# EAGLE design demo_robot_platform (EAGLE 9.6.2)
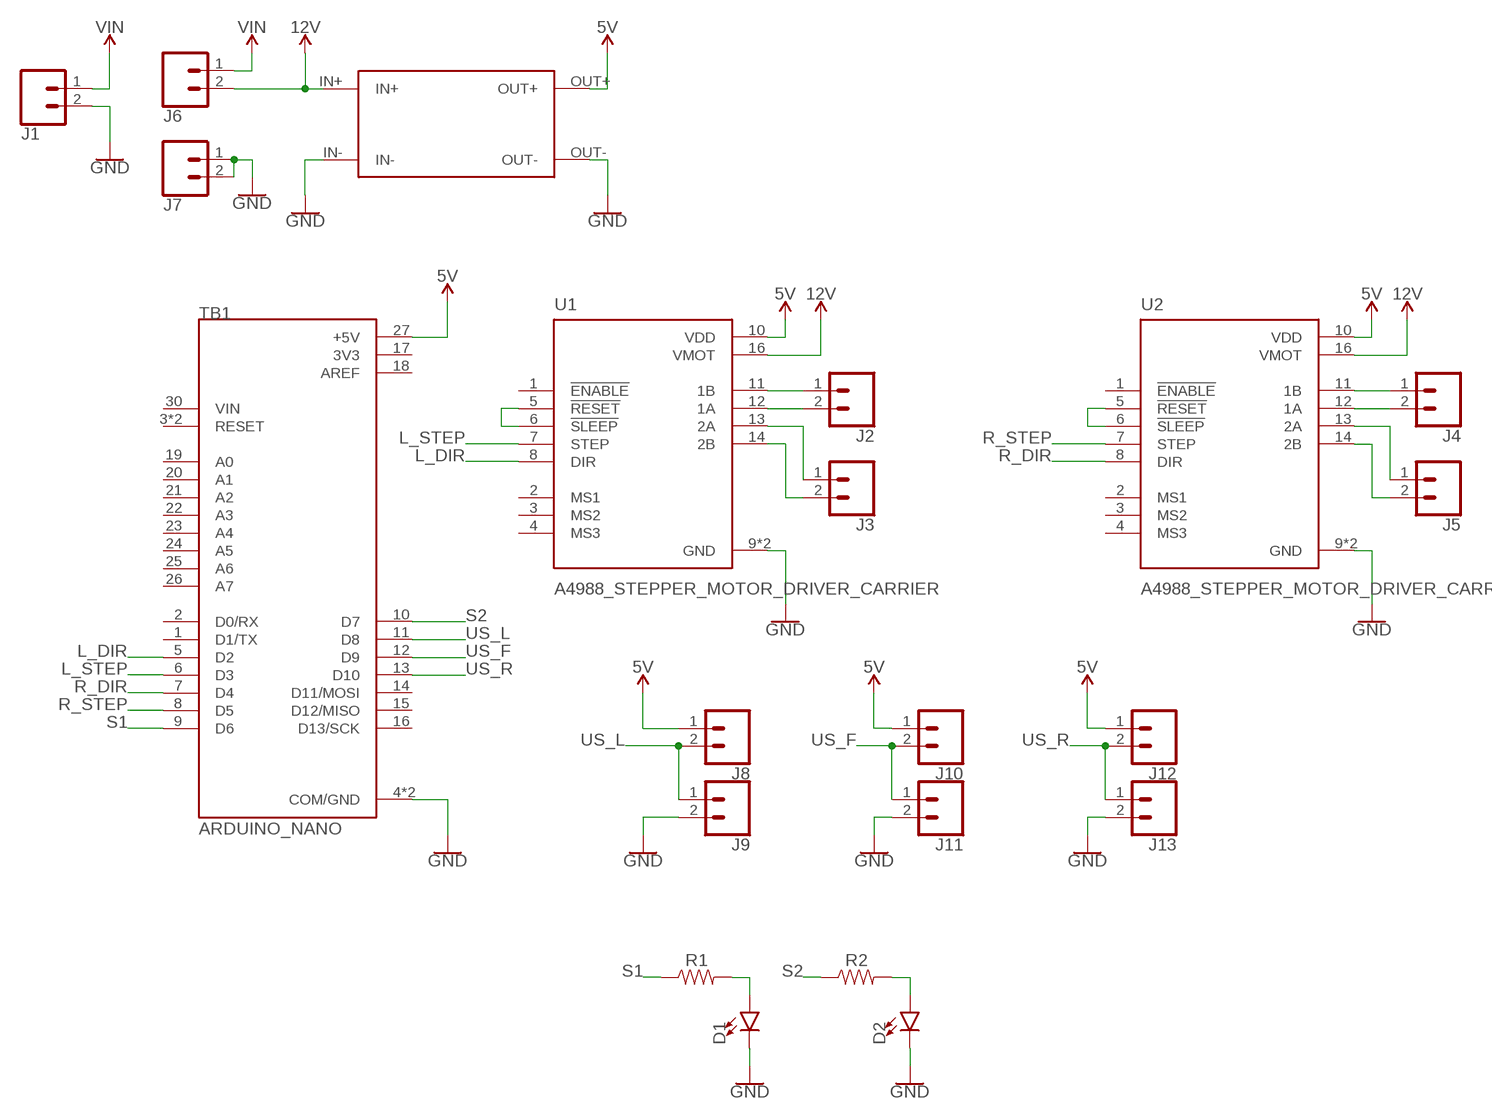
[diagram p0: schematic, sheet 1]

## Parts
D1  LED5MM  [LED_5MM]
D2  LED5MM  [LED_5MM]
J1  CONN_025MM  [SCREWTERMINAL-5MM-2]
J2  CONN_025MM  [SCREWTERMINAL-5MM-2]
J3  CONN_025MM  [SCREWTERMINAL-5MM-2]
J4  CONN_025MM  [SCREWTERMINAL-5MM-2]
J5  CONN_025MM  [SCREWTERMINAL-5MM-2]
J6  CONN_025MM  [SCREWTERMINAL-5MM-2]
J7  CONN_025MM  [SCREWTERMINAL-5MM-2]
J8  CONN_025MM  [SCREWTERMINAL-5MM-2]
J9  CONN_025MM  [SCREWTERMINAL-5MM-2]
J10  CONN_025MM  [SCREWTERMINAL-5MM-2]
J11  CONN_025MM  [SCREWTERMINAL-5MM-2]
J12  CONN_025MM  [SCREWTERMINAL-5MM-2]
J13  CONN_025MM  [SCREWTERMINAL-5MM-2]
R1  RESISTORAXIAL-0.3  [AXIAL-0.3]
R2  RESISTORAXIAL-0.3  [AXIAL-0.3]
TB1  ARDUINO_NANO  [SHIELD_ARDUINO_NANO]
U1  A4988_STEPPER_MOTOR_DRIVER_CARRIER  [MODULE_A4988_STEPPER_MOTOR_DRIVER_CARRIER]
U2  A4988_STEPPER_MOTOR_DRIVER_CARRIER  [MODULE_A4988_STEPPER_MOTOR_DRIVER_CARRIER]
U$1  DC_DC_CONVERTER  [DC_DC_CONVERTER]

## Nets
5V: J8.1 J10.1 J12.1 TB1.27(+5V) U1.10(VDD) U2.10(VDD) U$1.OUT+
12V: J6.2 U1.16(VMOT) U2.16(VMOT) U$1.IN+
GND: D1.K(C) D2.K(C) J1.2 J7.1 J7.2 J9.2 J11.2 J13.2 TB1.4(COM/GND) TB1.29(COM/GND) U1.9(GND) U1.15(GND) U2.9(GND) U2.15(GND) U$1.IN- U$1.OUT-
L_DIR: TB1.5(D2) U1.8(DIR)
L_STEP: TB1.6(D3) U1.7(STEP)
N$1: J2.1 U1.11(1B)
N$2: J2.2 U1.12(1A)
N$3: J3.1 U1.13(2A)
N$4: J3.2 U1.14(2B)
N$5: J4.1 U2.11(1B)
N$6: J4.2 U2.12(1A)
N$7: J5.1 U2.13(2A)
N$8: J5.2 U2.14(2B)
N$9: U1.5(!RESET) U1.6(!SLEEP)
N$10: U2.5(!RESET) U2.6(!SLEEP)
N$13: D1.A R1.P$2
N$14: D2.A R2.P$2
R_DIR: TB1.7(D4) U2.8(DIR)
R_STEP: TB1.8(D5) U2.7(STEP)
S1: R1.P$1 TB1.9(D6)
S2: R2.P$1 TB1.10(D7)
US_F: J10.2 J11.1 TB1.12(D9)
US_L: J8.2 J9.1 TB1.11(D8)
US_R: J12.2 J13.1 TB1.13(D10)
VIN: J1.1 J6.1
Unconnected: TB1.1(D1/TX) TB1.2(D0/RX) TB1.3(RESET) TB1.14(D11/MOSI) TB1.15(D12/MISO) TB1.16(D13/SCK) TB1.19(A0) TB1.20(A1) TB1.21(A2) TB1.22(A3) TB1.23(A4) TB1.24(A5) TB1.25(A6) TB1.26(A7) TB1.28(RESET) TB1.30(VIN) U1.1(!ENABLE) U1.2(MS1) U1.3(MS2) U1.4(MS3) U2.1(!ENABLE) U2.2(MS1) U2.3(MS2) U2.4(MS3)

## Power pins joined to a net without a drawn wire
3V3: TB1.17(3V3)
AREF: TB1.18(AREF)

## Library data of the parts
D1 D2 = SparkFun-LED:LED: LED (Generic) Standard schematic elements and footprints for 5mm, 3mm, 1206, and 0603 sized LEDs. Generic LEDs with no color specified.
J1-J13 = SparkFun-Connectors:CONN_02: Multi connection point. Often used as Generic Header-pin footprint for 0.1 inch spaced/style header connections On any of the 0.1 inch spaced packages, you can populate with these: Break Away Headers - Straight <https://www.sparkfun.com/products/116> (PRT-00116) Break Away Male Headers - Right Angle <https://www.sparkfun.com/products/553> (PRT-00553) Female Headers <https://www.sparkfun.com/products/115> (PRT-00115) Break Away Headers - Machine Pin <https://www.sparkfun.com/products/117> (PRT-00117) Break Away Female Headers - Swiss Machine Pin <https://www.sparkfun.com/products/743> (PRT-00743) For SCREWTERMINALS and SPRING TERMINALS visit here: Screw Terimnals on SparkFun.com <https://www.sparkfun.com/search/results?term=Screw+Terminals> (5mm/3.5mm/2.54mm spacing) This device is also useful as a general connection point to wire up your design to another part of your project. Our various solder wires solder well into these plated through hole pads. Hook-Up Wire - Assortment (Stranded, 22 AWG) <https://www.sparkfun.com/products/11375> (PRT-11375) Hook-Up Wire - Assortment (Solid Core, 22 AWG) <https://www.sparkfun.com/products/11367> (PRT-11367) View the entire wire category on our website here <https://www.sparkfun.com/categories/141> Special notes: Molex polarized connector foot print use with: PRT-08233 with associated crimp pins and housings. 2.54_SCREWTERM for use with PRT-10571. 3.5mm Screw Terminal footprints for PRT-08084 5mm Screw Terminal footprints for use with PRT-08432; SF_SKU: PRT-08432
R1 R2 = SparkFun-Resistors:RESISTOR: Generic Resistor Package
TB1 = ARDUINO_NANO:ARDUINO_NANO: Arduino Nano, Through Hole Check availability <https://pricing.snapeda.com/parts/Arduino%20Nano/Arduino/view-part?ref=eda>; AVAILABILITY: Not in stock; DESCRIPTION: Small, complete, and breadboard-friendly board based on the ATmega328 (Arduino Nano 3.x); MF: Arduino; MP: Arduino Nano; PACKAGE: Non-Standard Arduino; PRICE: None
U1 U2 = A4988_STEPPER_MOTOR_DRIVER_CARRIER:A4988_STEPPER_MOTOR_DRIVER_CARRIER: Stepper motor controler; IC: A4988; 1A; Uin mot: 8÷35V Check availability <https://pricing.snapeda.com/parts/A4988%20STEPPER%20MOTOR%20DRIVER%20CARRIER/Pololu/view-part?ref=eda>; AVAILABILITY: Not in stock; DESCRIPTION: Stepper Motor Driver; MF: Pololu; MP: A4988 STEPPER MOTOR DRIVER CARRIER; PACKAGE: None; PRICE: None
U$1 = DC_DC_CONVERTER:DC_DC_CONVERTER

## Board
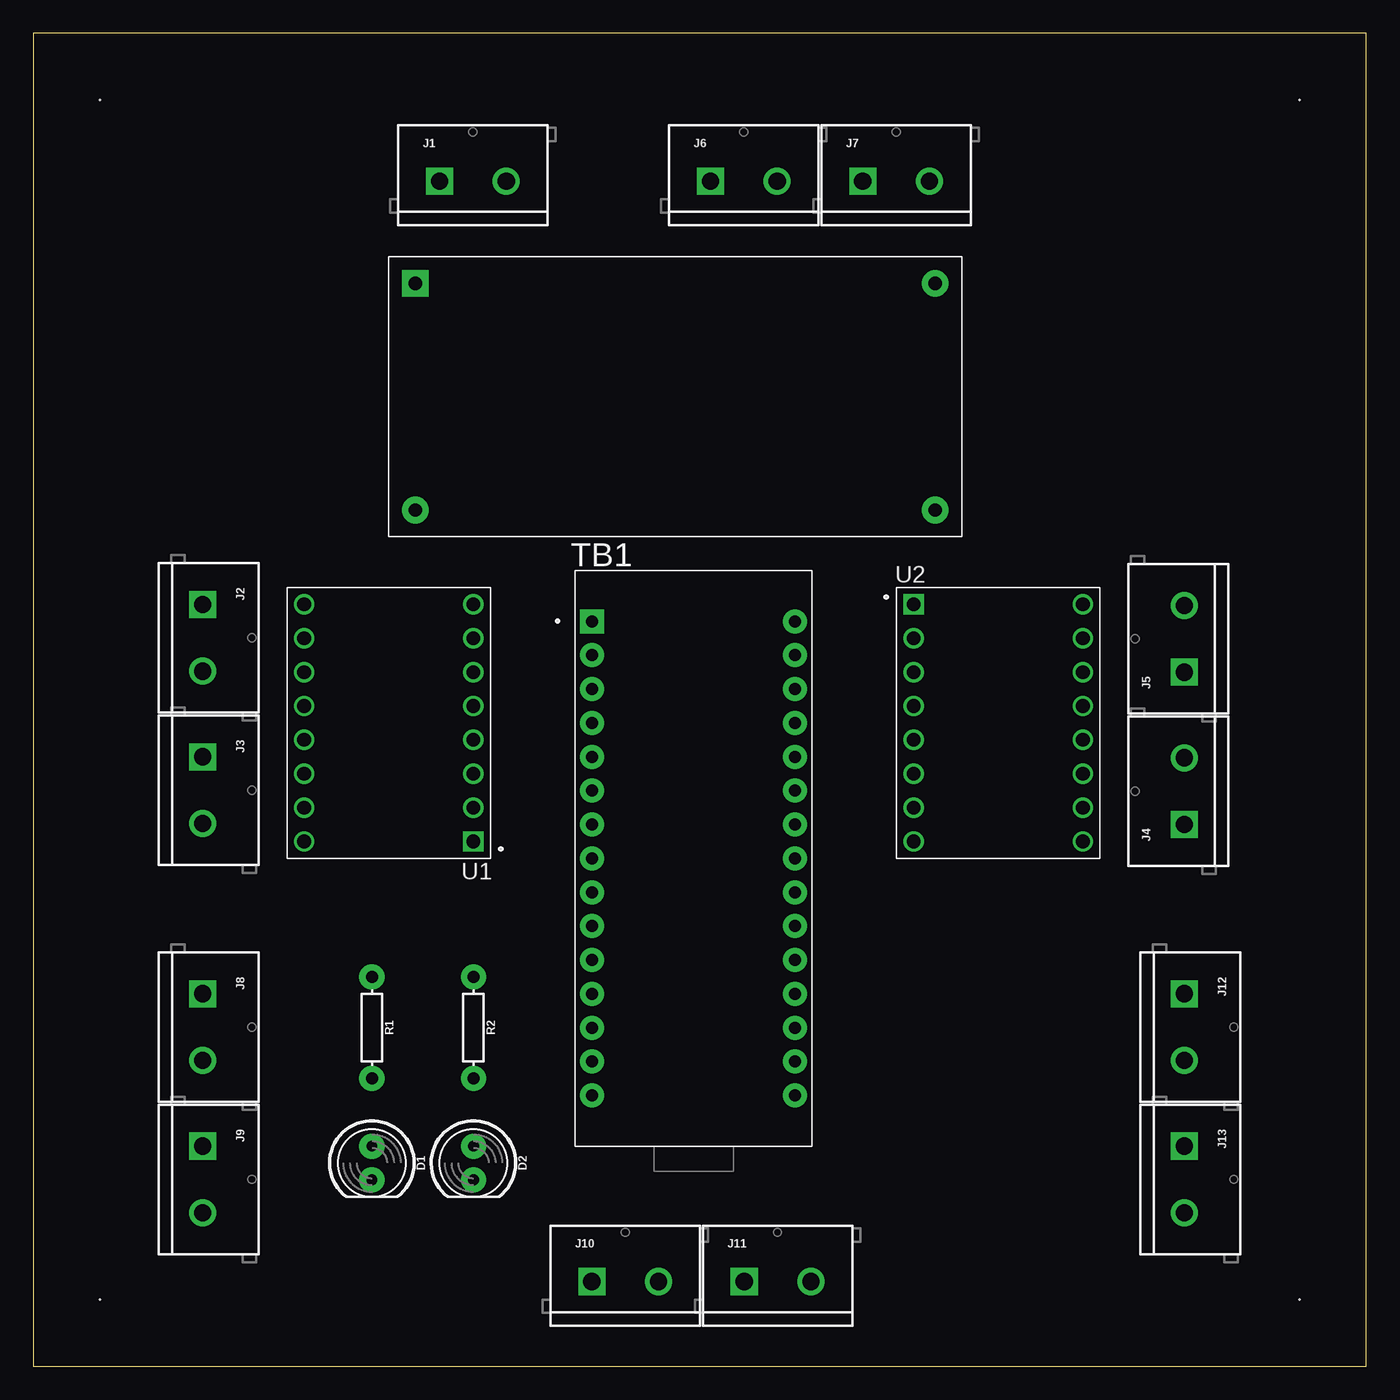
[diagram p1: board, top side]
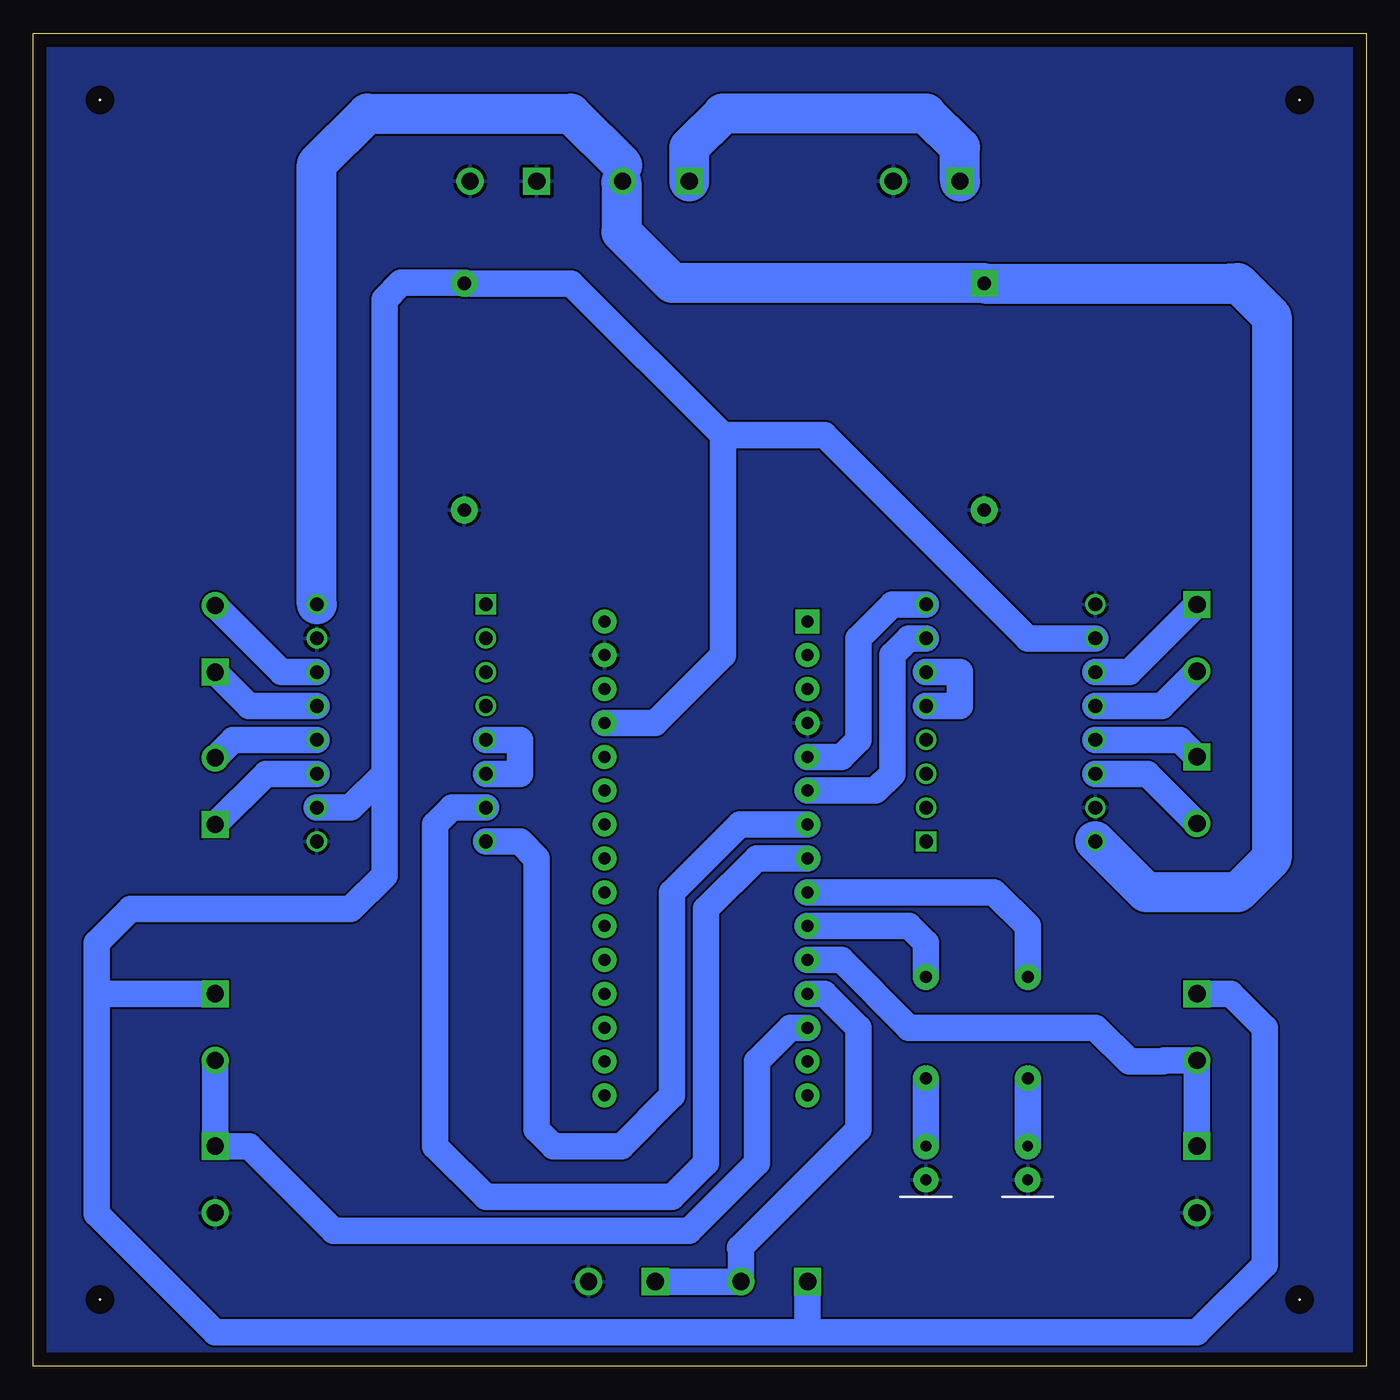
[diagram p2: board, bottom side, seen from below]

Size 100 x 100 mm. Coordinates in mm from the lower left corner, seen from the top.
Outline: 0,0 100,0 100,100 0,100 0,0
Copper layers (1*16): Top 0.035mm / dielectric 1.5mm / Bottom 0.035mm
Design rules "default": minimum track width 6mil, minimum drill 0.35mm, track to track 6mil, track to pad 6mil, pad to pad 6mil, via to via 6mil, smd to smd 6mil, copper to edge 40mil, drill to drill 6mil, minimum pad ring 10mil, minimum via ring 8mil, stop-mask expansion 4mil, vias tented up to drill 0mil, thermal gap 10mil
Holes 0.08 mm at 5,5 95,5 95,95 5,95

### Footprints (pad centres in the part's own frame; a part is rotated, then mirrored left to right if it is on the bottom)
LED_5MM = drill 0.813 pad 1.88: A -1.27,0; K 1.27,0
SCREWTERMINAL-5MM-2 = drill 1.3 pad 2.032 square: 1 0,0 | drill 1.3 pad 2.032: 2 5,0
AXIAL-0.3 = drill 0.9 pad 1.88: P$1 -3.81,0; P$2 3.81,0
SHIELD_ARDUINO_NANO = drill 0.9 pad 1.8 square: 1 -7.62,17.78 | drill 0.9 pad 1.8: 2 -7.62,15.24; 3 -7.62,12.7; 4 -7.62,10.16; 5 -7.62,7.62; 6 -7.62,5.08; 7 -7.62,2.54; 8 -7.62,0; 9 -7.62,-2.54; 10 -7.62,-5.08; 11 -7.62,-7.62; 12 -7.62,-10.16; 13 -7.62,-12.7; 14 -7.62,-15.24; 15 -7.62,-17.78; 16 7.62,-17.78; 17 7.62,-15.24; 18 7.62,-12.7; 19 7.62,-10.16; 20 7.62,-7.62; 21 7.62,-5.08; 22 7.62,-2.54; 23 7.62,0; 24 7.62,2.54; 25 7.62,5.08; 26 7.62,7.62; 27 7.62,10.16; 28 7.62,12.7; 29 7.62,15.24; 30 7.62,17.78
MODULE_A4988_STEPPER_MOTOR_DRIVER_CARRIER = drill 1.02 square: 1 -6.35,8.89 | drill 1.02: 2 -6.35,6.35; 3 -6.35,3.81; 4 -6.35,1.27; 5 -6.35,-1.27; 6 -6.35,-3.81; 7 -6.35,-6.35; 8 -6.35,-8.89; 9 6.35,-8.89; 10 6.35,-6.35; 11 6.35,-3.81; 12 6.35,-1.27; 13 6.35,1.27; 14 6.35,3.81; 15 6.35,6.35; 16 6.35,8.89
DC_DC_CONVERTER = drill 1 pad 2 square: IN+ 2,19 | drill 1 pad 2: IN- 2,2; OUT+ 41,19; OUT- 41,2

### Placement (x,y rotation side)
D1  25.4,15.24 270 top
D2  33.02,15.24 270 top
J1  30.48,88.9 0 top
J2  12.7,57.15 270 top
J3  12.7,45.72 270 top
J4  86.36,40.64 90 top
J5  86.36,52.07 90 top
J6  50.8,88.9 0 top
J7  62.23,88.9 0 top
J8  12.7,27.94 270 top
J9  12.7,16.51 270 top
J10  41.91,6.35 0 top
J11  53.34,6.35 0 top
J12  86.36,27.94 270 top
J13  86.36,16.51 270 top
R1  25.4,25.4 270 top
R2  33.02,25.4 270 top
TB1  49.53,38.1 0 top
U1  26.67,48.26 180 top
U2  72.39,48.26 0 top
U$1  26.67,62.23 0 top

### Tracks (layer width: path | path; a pad name or v marks a point on that pad's centre or on a via)
5V
  Bottom 2: 48.26,69.85 59.64,81.23 U$1.OUT+ 67.62,81.28 72.39,81.28 73.66,80.01 73.66,44.45 | 48.26,69.85 48.26,53.34 53.34,48.26 TB1.27 | U2.10 76.2,41.91 73.66,44.45 | 48.26,69.85 40.64,69.85 25.4,54.61 U1.10 | 73.66,44.45 73.66,36.83 76.2,34.29 92.71,34.29 95.25,31.75 95.25,27.94 | 95.25,27.94 95.25,11.43 86.36,2.54 41.91,2.54 | 41.91,2.54 12.7,2.54 7.62,7.62 7.62,25.4 10.16,27.94 J8.1 | J10.1 41.91,2.54 | J12.1 95.25,27.94
12V
  Bottom 2: 10.21,81.23 10.16,81.28 9.64,81.28 | U$1.IN+ 28.72,81.28 | J6.2 55.88,88.98 | 55.8,90.09 J6.2 | J6.2 55.88,88.82
  Bottom 3: U$1.IN+ 10.21,81.23 | 9.64,81.28 7.1,78.74 7.1,38.1 9.64,35.56 16.51,35.56 U1.16 | 28.72,81.28 52.07,81.28 55.88,85.09 55.88,88.82 | U2.16 78.74,90.17 74.93,93.98 59.69,93.98 55.8,90.09
GND
  pour Bottom: 0,100 0,0 100,0 100,100
L_DIR
  Bottom 2: TB1.5 39.37,45.72 38.1,46.99 38.1,54.61 35.56,57.15 U1.8
L_STEP
  Bottom 2: U1.7 34.29,54.61 35.56,53.34 35.56,44.45 36.83,43.18 TB1.6
N$1
  Bottom 2: J2.1 17.78,52.07 U1.11
N$2
  Bottom 2: J2.2 15.32,49.53 U1.12
N$3
  Bottom 2: J3.1 13.97,46.99 U1.13
N$4
  Bottom 2: J3.2 16.43,44.45 U1.14
N$5
  Bottom 2: U2.11 82.55,44.45 J4.1
N$6
  Bottom 2: U2.12 85.01,46.99 J4.2
N$7
  Bottom 2: J5.1 83.82,49.53 U2.13
N$8
  Bottom 2: J5.2 81.36,52.07 U2.14
N$9
  Bottom 2: U1.6 30.48,52.07 30.48,49.53 U1.5
N$10
  Bottom 2: U2.5 63.5,46.99 63.5,44.45 U2.6
N$13
  Bottom 2: R1.P$2 D1.A
N$14
  Bottom 2: R2.P$2 D2.A
R_DIR
  Bottom 2: U2.8 63.5,39.37 62.23,38.1 62.23,17.78 60.96,16.51 55.88,16.51 52.07,20.32 52.07,35.56 46.99,40.64 TB1.7
R_STEP
  Bottom 2: TB1.8 45.72,38.1 49.53,34.29 49.53,15.24 52.07,12.7 66.04,12.7 69.85,16.51 69.85,40.64 68.58,41.91 U2.7
S1
  Bottom 2: TB1.9 27.94,35.56 25.4,33.02 R1.P$1
S2
  Bottom 2: R2.P$1 33.02,31.75 34.29,33.02 TB1.10
US_F
  Bottom 2: TB1.12 40.64,27.94 38.1,25.4 38.1,17.78 46.99,8.89 46.91,8.81 J10.2 J11.1
US_L
  Bottom 2: J9.1 J8.2 15.16,22.94 15.24,22.86 17.78,22.86 20.32,25.4 34.29,25.4 39.37,30.48 TB1.11
US_R
  Bottom 2: TB1.13 43.18,25.4 45.72,22.86 45.72,15.24 50.8,10.16 77.47,10.16 83.82,16.51 J13.1 J12.2
VIN
  Bottom 3: J1.1 30.48,91.44 33.02,93.98 48.26,93.98 50.8,91.44 J6.1